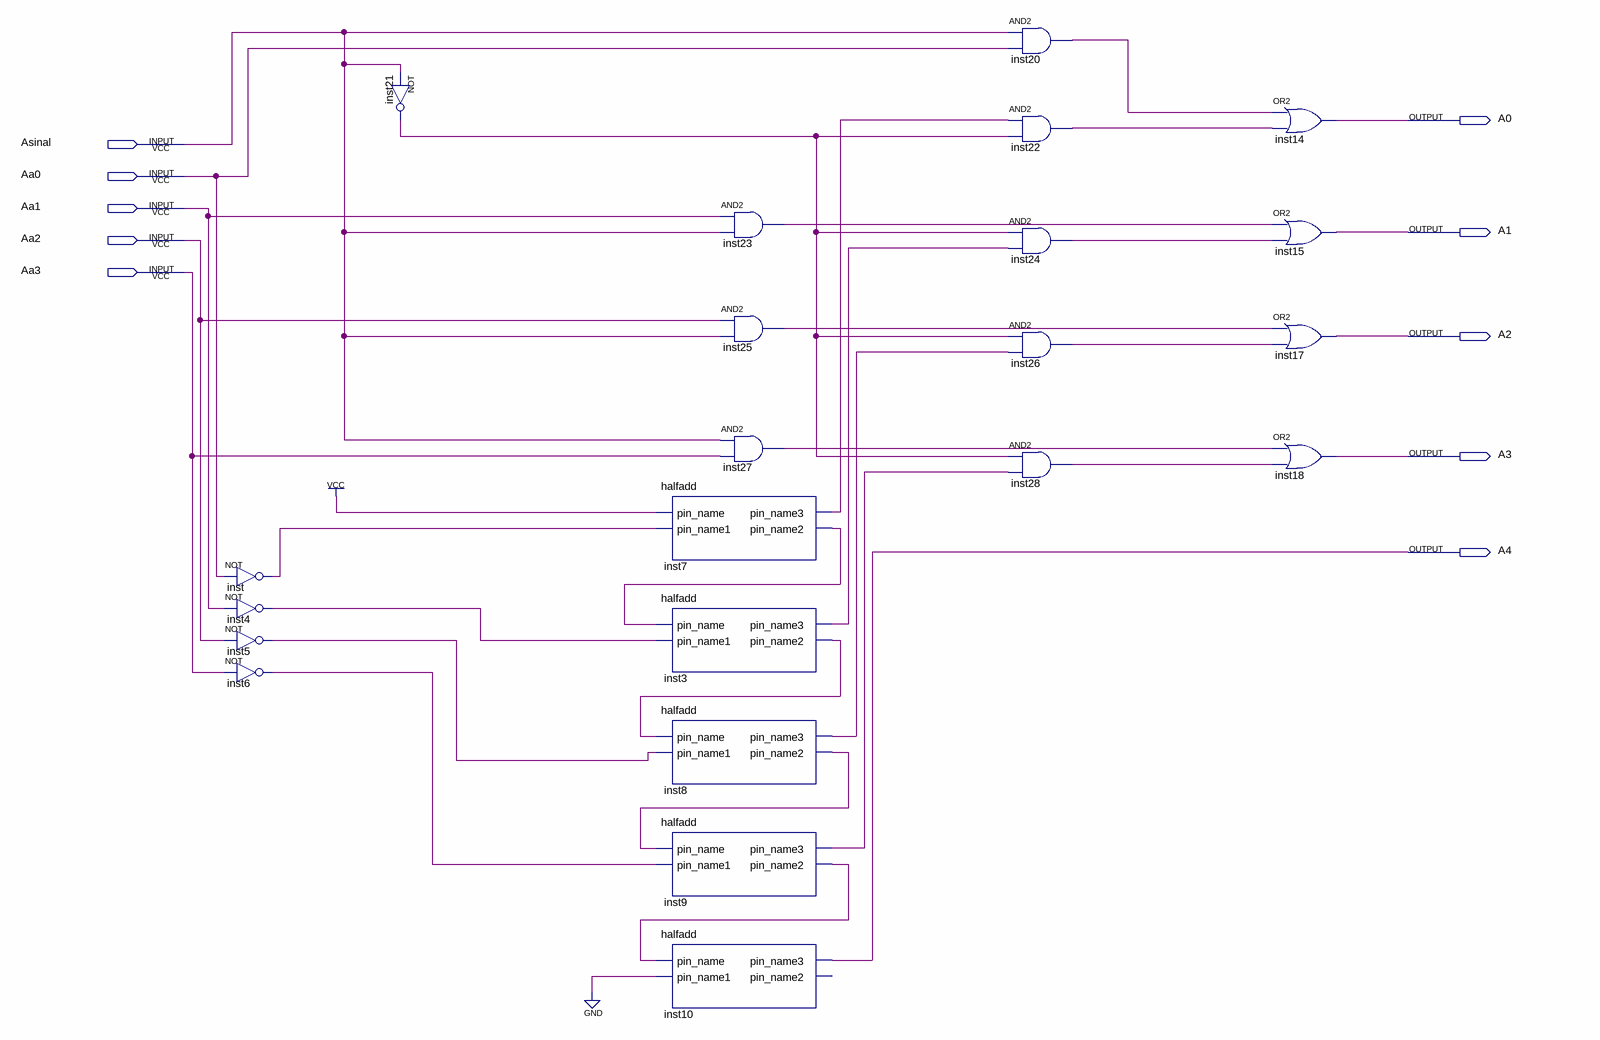
[diagram p0: schematic sheet]
// Quartus schematic Comp2.bdf as structural Verilog: 22 symbols, 10 pins
module Comp2 (
  input  Asinal,
  input  Aa0,
  input  Aa1,
  input  Aa2,
  input  Aa3,
  output A0,
  output A1,
  output A2,
  output A3,
  output A4
);

  wire inst3_pin_name2, inst3_pin_name3, inst4_out, inst5_out, inst6_out, inst7_pin_name2, inst7_pin_name3,
       inst8_pin_name2, inst8_pin_name3, inst9_pin_name2, inst9_pin_name3, inst20_out, inst21_out,
       inst22_out, inst23_out, inst24_out, inst25_out, inst26_out, inst27_out, inst28_out, inst_out;

  not inst (inst_out, Aa0);
  not inst4 (inst4_out, Aa1);
  not inst5 (inst5_out, Aa2);
  not inst6 (inst6_out, Aa3);
  not inst21 (inst21_out, Asinal);
  halfadd inst7 (.pin_name(1'b1), .pin_name1(inst_out), .pin_name3(inst7_pin_name3), .pin_name2(inst7_pin_name2));
  halfadd inst3 (
    .pin_name(inst7_pin_name2), .pin_name1(inst4_out), .pin_name3(inst3_pin_name3),
    .pin_name2(inst3_pin_name2));
  halfadd inst8 (
    .pin_name(inst3_pin_name2), .pin_name1(inst5_out), .pin_name3(inst8_pin_name3),
    .pin_name2(inst8_pin_name2));
  halfadd inst9 (
    .pin_name(inst8_pin_name2), .pin_name1(inst6_out), .pin_name3(inst9_pin_name3),
    .pin_name2(inst9_pin_name2));
  halfadd inst10 (.pin_name(inst9_pin_name2), .pin_name1(1'b0), .pin_name3(A4));  // open: pin_name2
  and inst23 (inst23_out, Aa1, Asinal);
  and inst25 (inst25_out, Aa2, Asinal);
  and inst27 (inst27_out, Asinal, Aa3);
  and inst20 (inst20_out, Asinal, Aa0);
  and inst22 (inst22_out, inst7_pin_name3, inst21_out);
  and inst24 (inst24_out, inst21_out, inst3_pin_name3);
  and inst26 (inst26_out, inst21_out, inst8_pin_name3);
  and inst28 (inst28_out, inst21_out, inst9_pin_name3);
  or inst14 (A0, inst20_out, inst22_out);
  or inst15 (A1, inst23_out, inst24_out);
  or inst17 (A2, inst25_out, inst26_out);
  or inst18 (A3, inst27_out, inst28_out);
endmodule
